# EAGLE design TaaraNodeEthernetProto (EAGLE 6.5.0)
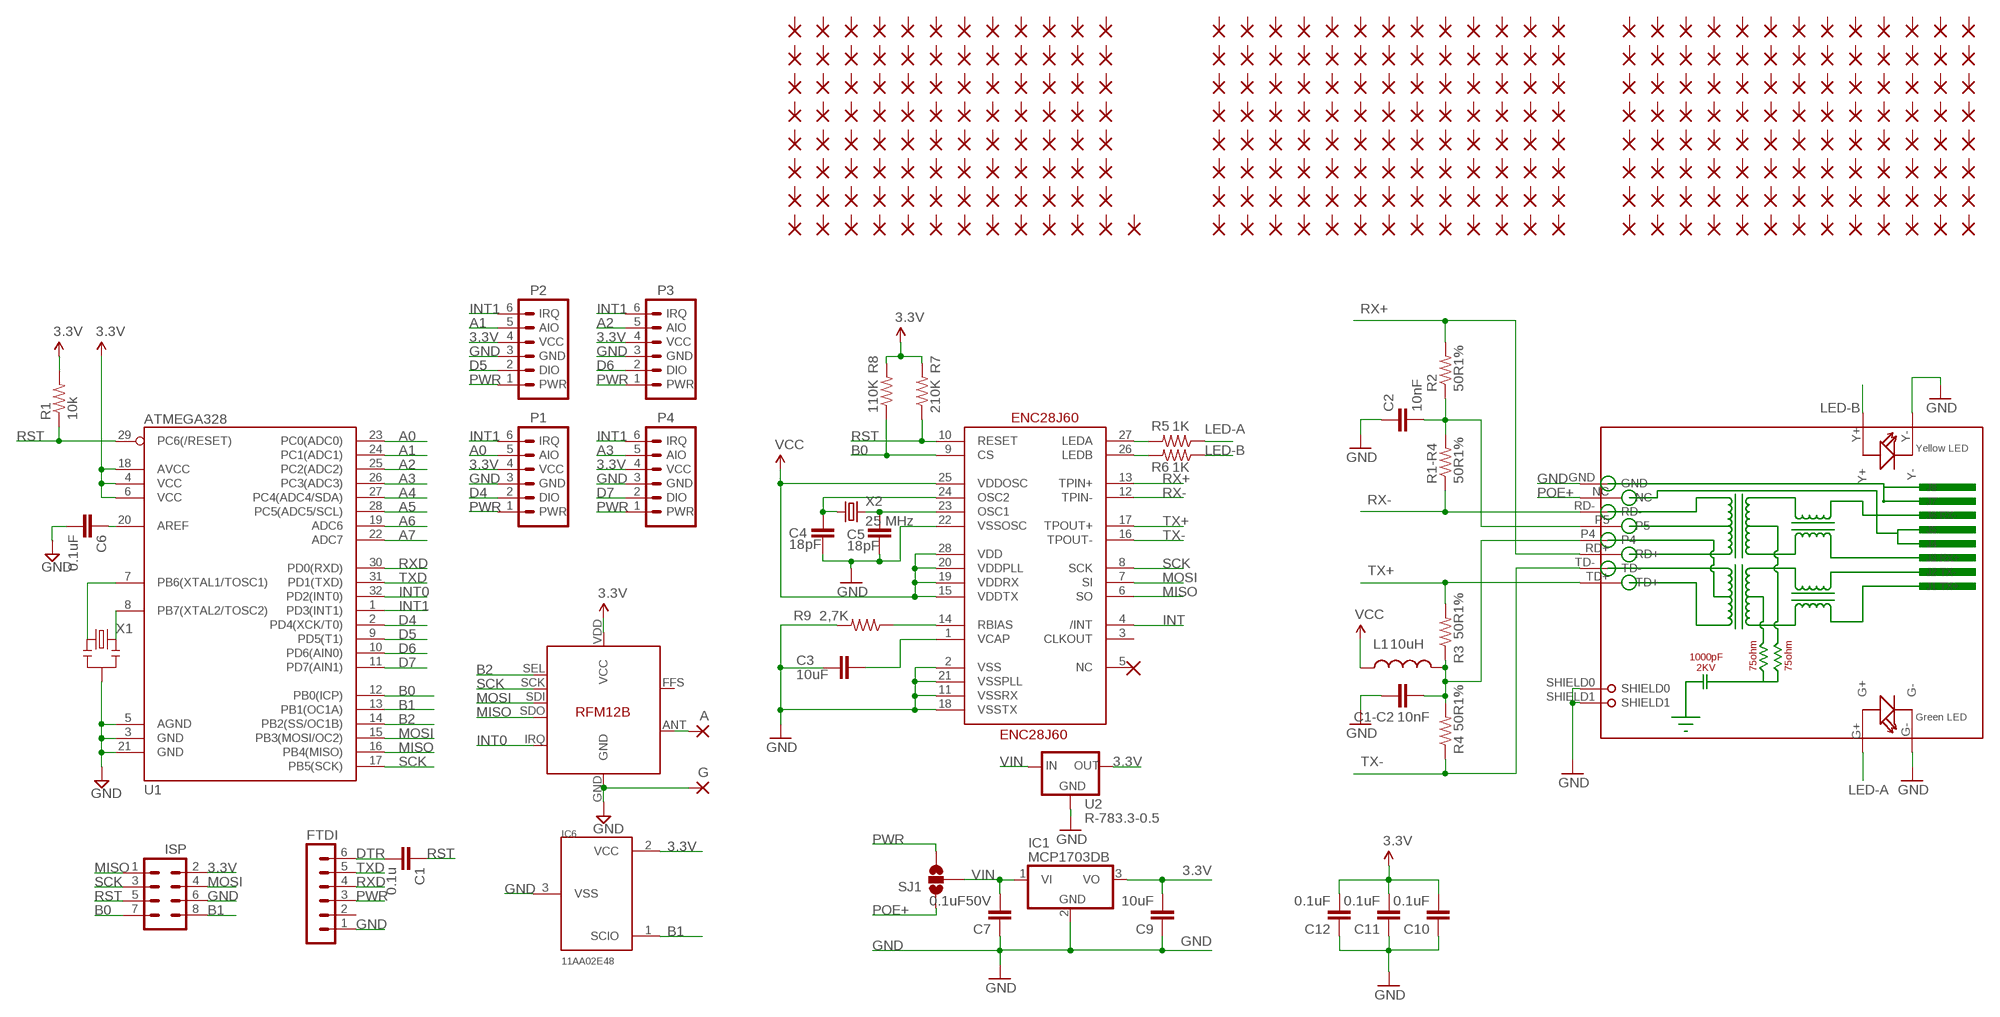
[diagram p0: schematic, sheet 1]

## Parts
A  1,6/0,8  [1,6/0,8]
C1  0.1u  CAP0603-CAP  [0603-CAP]
C1-C2  10nF  CAP0603-CAP  [0603-CAP]
C2  10nF  CAP0603-CAP  [0603-CAP]
C3  10uF  CAP0603-CAP  [0603-CAP]
C4  18pF  CAP0603-CAP  [0603-CAP]
C5  18pF  CAP0603-CAP  [0603-CAP]
C6  0.1uF  CAP0603-CAP  [0603-CAP]
C7  0.1uF50V  CAP0603-CAP  [0603-CAP]
C9  10uF  CAP0603-CAP  [0603-CAP]
C10  0.1uF  CAP0603-CAP  [0603-CAP]
C11  0.1uF  CAP0603-CAP  [0603-CAP]
C12  0.1uF  CAP0603-CAP  [0603-CAP]
ENC28J60  ENC28J60  [SSOP28DB]
FTDI  MA06-1  [MA06-1]
G  1,6/0,8  [1,6/0,8]
IC1  MCP1703DB  [SOT223]
IC6  11AA02E48  [SOT23]
L1  10uH  INDUCTOR0805  [0805]
P1  JEEPORT-FEMALE  [1X06_FEMALE_LOCK.010]
P2  JEEPORT-FEMALE  [1X06_FEMALE_LOCK.010]
P3  JEEPORT-FEMALE  [1X06_FEMALE_LOCK.010]
P4  JEEPORT-FEMALE  [1X06_FEMALE_LOCK.010]
PAD1  1,6/0,8  [1,6/0,8]
PAD2  1,6/0,8  [1,6/0,8]
PAD3  1,6/0,8  [1,6/0,8]
PAD4  1,6/0,8  [1,6/0,8]
PAD5  1,6/0,8  [1,6/0,8]
PAD6  1,6/0,8  [1,6/0,8]
PAD7  1,6/0,8  [1,6/0,8]
PAD8  1,6/0,8  [1,6/0,8]
PAD9  1,6/0,8  [1,6/0,8]
PAD10  1,6/0,8  [1,6/0,8]
PAD11  1,6/0,8  [1,6/0,8]
PAD12  1,6/0,8  [1,6/0,8]
PAD13  1,6/0,8  [1,6/0,8]
PAD14  1,6/0,8  [1,6/0,8]
PAD15  1,6/0,8  [1,6/0,8]
PAD16  1,6/0,8  [1,6/0,8]
PAD17  1,6/0,8  [1,6/0,8]
PAD18  1,6/0,8  [1,6/0,8]
PAD19  1,6/0,8  [1,6/0,8]
PAD20  1,6/0,8  [1,6/0,8]
PAD21  1,6/0,8  [1,6/0,8]
PAD22  1,6/0,8  [1,6/0,8]
PAD23  1,6/0,8  [1,6/0,8]
PAD24  1,6/0,8  [1,6/0,8]
PAD25  1,6/0,8  [1,6/0,8]
PAD26  1,6/0,8  [1,6/0,8]
PAD27  1,6/0,8  [1,6/0,8]
PAD28  1,6/0,8  [1,6/0,8]
PAD29  1,6/0,8  [1,6/0,8]
PAD30  1,6/0,8  [1,6/0,8]
PAD31  1,6/0,8  [1,6/0,8]
PAD32  1,6/0,8  [1,6/0,8]
PAD33  1,6/0,8  [1,6/0,8]
PAD34  1,6/0,8  [1,6/0,8]
PAD35  1,6/0,8  [1,6/0,8]
PAD36  1,6/0,8  [1,6/0,8]
PAD37  1,6/0,8  [1,6/0,8]
PAD38  1,6/0,8  [1,6/0,8]
PAD39  1,6/0,8  [1,6/0,8]
PAD40  1,6/0,8  [1,6/0,8]
PAD41  1,6/0,8  [1,6/0,8]
PAD42  1,6/0,8  [1,6/0,8]
PAD43  1,6/0,8  [1,6/0,8]
PAD44  1,6/0,8  [1,6/0,8]
PAD45  1,6/0,8  [1,6/0,8]
PAD46  1,6/0,8  [1,6/0,8]
PAD47  1,6/0,8  [1,6/0,8]
PAD48  1,6/0,8  [1,6/0,8]
PAD49  1,6/0,8  [1,6/0,8]
PAD50  1,6/0,8  [1,6/0,8]
PAD51  1,6/0,8  [1,6/0,8]
PAD52  1,6/0,8  [1,6/0,8]
PAD53  1,6/0,8  [1,6/0,8]
PAD54  1,6/0,8  [1,6/0,8]
PAD55  1,6/0,8  [1,6/0,8]
PAD56  1,6/0,8  [1,6/0,8]
PAD57  1,6/0,8  [1,6/0,8]
PAD58  1,6/0,8  [1,6/0,8]
PAD59  1,6/0,8  [1,6/0,8]
PAD60  1,6/0,8  [1,6/0,8]
PAD61  1,6/0,8  [1,6/0,8]
PAD62  1,6/0,8  [1,6/0,8]
PAD63  1,6/0,8  [1,6/0,8]
PAD64  1,6/0,8  [1,6/0,8]
PAD65  1,6/0,8  [1,6/0,8]
PAD66  1,6/0,8  [1,6/0,8]
PAD67  1,6/0,8  [1,6/0,8]
PAD68  1,6/0,8  [1,6/0,8]
PAD69  1,6/0,8  [1,6/0,8]
PAD70  1,6/0,8  [1,6/0,8]
PAD71  1,6/0,8  [1,6/0,8]
PAD72  1,6/0,8  [1,6/0,8]
PAD73  1,6/0,8  [1,6/0,8]
PAD74  1,6/0,8  [1,6/0,8]
PAD75  1,6/0,8  [1,6/0,8]
PAD76  1,6/0,8  [1,6/0,8]
PAD77  1,6/0,8  [1,6/0,8]
PAD78  1,6/0,8  [1,6/0,8]
PAD79  1,6/0,8  [1,6/0,8]
PAD80  1,6/0,8  [1,6/0,8]
PAD81  1,6/0,8  [1,6/0,8]
PAD82  1,6/0,8  [1,6/0,8]
PAD83  1,6/0,8  [1,6/0,8]
PAD84  1,6/0,8  [1,6/0,8]
PAD85  1,6/0,8  [1,6/0,8]
PAD86  1,6/0,8  [1,6/0,8]
PAD87  1,6/0,8  [1,6/0,8]
PAD88  1,6/0,8  [1,6/0,8]
PAD89  1,6/0,8  [1,6/0,8]
PAD90  1,6/0,8  [1,6/0,8]
PAD91  1,6/0,8  [1,6/0,8]
PAD92  1,6/0,8  [1,6/0,8]
PAD93  1,6/0,8  [1,6/0,8]
PAD94  1,6/0,8  [1,6/0,8]
PAD95  1,6/0,8  [1,6/0,8]
PAD96  1,6/0,8  [1,6/0,8]
PAD97  1,6/0,8  [1,6/0,8]
PAD98  1,6/0,8  [1,6/0,8]
PAD99  1,6/0,8  [1,6/0,8]
PAD100  1,6/0,8  [1,6/0,8]
PAD101  1,6/0,8  [1,6/0,8]
PAD102  1,6/0,8  [1,6/0,8]
PAD103  1,6/0,8  [1,6/0,8]
PAD104  1,6/0,8  [1,6/0,8]
PAD105  1,6/0,8  [1,6/0,8]
PAD106  1,6/0,8  [1,6/0,8]
PAD107  1,6/0,8  [1,6/0,8]
PAD108  1,6/0,8  [1,6/0,8]
PAD109  1,6/0,8  [1,6/0,8]
PAD110  1,6/0,8  [1,6/0,8]
PAD111  1,6/0,8  [1,6/0,8]
PAD112  1,6/0,8  [1,6/0,8]
PAD113  1,6/0,8  [1,6/0,8]
PAD114  1,6/0,8  [1,6/0,8]
PAD115  1,6/0,8  [1,6/0,8]
PAD116  1,6/0,8  [1,6/0,8]
PAD117  1,6/0,8  [1,6/0,8]
PAD118  1,6/0,8  [1,6/0,8]
PAD119  1,6/0,8  [1,6/0,8]
PAD120  1,6/0,8  [1,6/0,8]
PAD121  1,6/0,8  [1,6/0,8]
PAD122  1,6/0,8  [1,6/0,8]
PAD123  1,6/0,8  [1,6/0,8]
PAD124  1,6/0,8  [1,6/0,8]
PAD125  1,6/0,8  [1,6/0,8]
PAD126  1,6/0,8  [1,6/0,8]
PAD127  1,6/0,8  [1,6/0,8]
PAD128  1,6/0,8  [1,6/0,8]
PAD129  1,6/0,8  [1,6/0,8]
PAD130  1,6/0,8  [1,6/0,8]
PAD131  1,6/0,8  [1,6/0,8]
PAD132  1,6/0,8  [1,6/0,8]
PAD133  1,6/0,8  [1,6/0,8]
PAD134  1,6/0,8  [1,6/0,8]
PAD135  1,6/0,8  [1,6/0,8]
PAD136  1,6/0,8  [1,6/0,8]
PAD137  1,6/0,8  [1,6/0,8]
PAD138  1,6/0,8  [1,6/0,8]
PAD139  1,6/0,8  [1,6/0,8]
PAD140  1,6/0,8  [1,6/0,8]
PAD141  1,6/0,8  [1,6/0,8]
PAD142  1,6/0,8  [1,6/0,8]
PAD143  1,6/0,8  [1,6/0,8]
PAD144  1,6/0,8  [1,6/0,8]
PAD145  1,6/0,8  [1,6/0,8]
PAD146  1,6/0,8  [1,6/0,8]
PAD147  1,6/0,8  [1,6/0,8]
PAD148  1,6/0,8  [1,6/0,8]
PAD149  1,6/0,8  [1,6/0,8]
PAD150  1,6/0,8  [1,6/0,8]
PAD151  1,6/0,8  [1,6/0,8]
PAD152  1,6/0,8  [1,6/0,8]
PAD153  1,6/0,8  [1,6/0,8]
PAD154  1,6/0,8  [1,6/0,8]
PAD155  1,6/0,8  [1,6/0,8]
PAD156  1,6/0,8  [1,6/0,8]
PAD157  1,6/0,8  [1,6/0,8]
PAD158  1,6/0,8  [1,6/0,8]
PAD159  1,6/0,8  [1,6/0,8]
PAD160  1,6/0,8  [1,6/0,8]
PAD161  1,6/0,8  [1,6/0,8]
PAD162  1,6/0,8  [1,6/0,8]
PAD163  1,6/0,8  [1,6/0,8]
PAD164  1,6/0,8  [1,6/0,8]
PAD165  1,6/0,8  [1,6/0,8]
PAD166  1,6/0,8  [1,6/0,8]
PAD167  1,6/0,8  [1,6/0,8]
PAD168  1,6/0,8  [1,6/0,8]
PAD169  1,6/0,8  [1,6/0,8]
PAD170  1,6/0,8  [1,6/0,8]
PAD171  1,6/0,8  [1,6/0,8]
PAD172  1,6/0,8  [1,6/0,8]
PAD173  1,6/0,8  [1,6/0,8]
PAD174  1,6/0,8  [1,6/0,8]
PAD175  1,6/0,8  [1,6/0,8]
PAD176  1,6/0,8  [1,6/0,8]
PAD177  1,6/0,8  [1,6/0,8]
PAD178  1,6/0,8  [1,6/0,8]
PAD179  1,6/0,8  [1,6/0,8]
PAD180  1,6/0,8  [1,6/0,8]
PAD181  1,6/0,8  [1,6/0,8]
PAD182  1,6/0,8  [1,6/0,8]
PAD183  1,6/0,8  [1,6/0,8]
PAD184  1,6/0,8  [1,6/0,8]
PAD185  1,6/0,8  [1,6/0,8]
PAD186  1,6/0,8  [1,6/0,8]
PAD187  1,6/0,8  [1,6/0,8]
PAD188  1,6/0,8  [1,6/0,8]
PAD189  1,6/0,8  [1,6/0,8]
PAD190  1,6/0,8  [1,6/0,8]
PAD191  1,6/0,8  [1,6/0,8]
PAD192  1,6/0,8  [1,6/0,8]
PAD193  1,6/0,8  [1,6/0,8]
PAD194  1,6/0,8  [1,6/0,8]
PAD195  1,6/0,8  [1,6/0,8]
PAD196  1,6/0,8  [1,6/0,8]
PAD197  1,6/0,8  [1,6/0,8]
PAD198  1,6/0,8  [1,6/0,8]
PAD199  1,6/0,8  [1,6/0,8]
PAD200  1,6/0,8  [1,6/0,8]
PAD201  1,6/0,8  [1,6/0,8]
PAD202  1,6/0,8  [1,6/0,8]
PAD203  1,6/0,8  [1,6/0,8]
PAD204  1,6/0,8  [1,6/0,8]
PAD205  1,6/0,8  [1,6/0,8]
PAD206  1,6/0,8  [1,6/0,8]
PAD207  1,6/0,8  [1,6/0,8]
PAD208  1,6/0,8  [1,6/0,8]
PAD209  1,6/0,8  [1,6/0,8]
PAD210  1,6/0,8  [1,6/0,8]
PAD211  1,6/0,8  [1,6/0,8]
PAD212  1,6/0,8  [1,6/0,8]
PAD213  1,6/0,8  [1,6/0,8]
PAD214  1,6/0,8  [1,6/0,8]
PAD215  1,6/0,8  [1,6/0,8]
PAD216  1,6/0,8  [1,6/0,8]
PAD217  1,6/0,8  [1,6/0,8]
PAD218  1,6/0,8  [1,6/0,8]
PAD219  1,6/0,8  [1,6/0,8]
PAD220  1,6/0,8  [1,6/0,8]
PAD221  1,6/0,8  [1,6/0,8]
PAD222  1,6/0,8  [1,6/0,8]
PAD223  1,6/0,8  [1,6/0,8]
PAD224  1,6/0,8  [1,6/0,8]
PAD225  1,6/0,8  [1,6/0,8]
PAD226  1,6/0,8  [1,6/0,8]
PAD227  1,6/0,8  [1,6/0,8]
PAD228  1,6/0,8  [1,6/0,8]
PAD229  1,6/0,8  [1,6/0,8]
PAD230  1,6/0,8  [1,6/0,8]
PAD231  1,6/0,8  [1,6/0,8]
PAD232  1,6/0,8  [1,6/0,8]
PAD233  1,6/0,8  [1,6/0,8]
PAD234  1,6/0,8  [1,6/0,8]
PAD235  1,6/0,8  [1,6/0,8]
PAD236  1,6/0,8  [1,6/0,8]
PAD237  1,6/0,8  [1,6/0,8]
PAD238  1,6/0,8  [1,6/0,8]
PAD239  1,6/0,8  [1,6/0,8]
PAD240  1,6/0,8  [1,6/0,8]
PAD241  1,6/0,8  [1,6/0,8]
PAD242  1,6/0,8  [1,6/0,8]
PAD243  1,6/0,8  [1,6/0,8]
PAD244  1,6/0,8  [1,6/0,8]
PAD245  1,6/0,8  [1,6/0,8]
PAD246  1,6/0,8  [1,6/0,8]
PAD247  1,6/0,8  [1,6/0,8]
PAD248  1,6/0,8  [1,6/0,8]
PAD249  1,6/0,8  [1,6/0,8]
PAD250  1,6/0,8  [1,6/0,8]
PAD251  1,6/0,8  [1,6/0,8]
PAD252  1,6/0,8  [1,6/0,8]
PAD253  1,6/0,8  [1,6/0,8]
PAD254  1,6/0,8  [1,6/0,8]
PAD255  1,6/0,8  [1,6/0,8]
PAD256  1,6/0,8  [1,6/0,8]
PAD257  1,6/0,8  [1,6/0,8]
PAD258  1,6/0,8  [1,6/0,8]
PAD259  1,6/0,8  [1,6/0,8]
PAD260  1,6/0,8  [1,6/0,8]
PAD261  1,6/0,8  [1,6/0,8]
PAD262  1,6/0,8  [1,6/0,8]
PAD263  1,6/0,8  [1,6/0,8]
PAD264  1,6/0,8  [1,6/0,8]
PAD265  1,6/0,8  [1,6/0,8]
PAD266  1,6/0,8  [1,6/0,8]
PAD267  1,6/0,8  [1,6/0,8]
PAD268  1,6/0,8  [1,6/0,8]
PAD269  1,6/0,8  [1,6/0,8]
PAD270  1,6/0,8  [1,6/0,8]
PAD271  1,6/0,8  [1,6/0,8]
PAD272  1,6/0,8  [1,6/0,8]
PAD273  1,6/0,8  [1,6/0,8]
PAD274  1,6/0,8  [1,6/0,8]
PAD275  1,6/0,8  [1,6/0,8]
PAD276  1,6/0,8  [1,6/0,8]
PAD277  1,6/0,8  [1,6/0,8]
PAD278  1,6/0,8  [1,6/0,8]
PAD279  1,6/0,8  [1,6/0,8]
PAD280  1,6/0,8  [1,6/0,8]
PAD281  1,6/0,8  [1,6/0,8]
PAD282  1,6/0,8  [1,6/0,8]
PAD283  1,6/0,8  [1,6/0,8]
PAD284  1,6/0,8  [1,6/0,8]
PAD285  1,6/0,8  [1,6/0,8]
PAD286  1,6/0,8  [1,6/0,8]
PAD287  1,6/0,8  [1,6/0,8]
PAD288  1,6/0,8  [1,6/0,8]
PAD289  1,6/0,8  [1,6/0,8]
PAD290  1,6/0,8  [1,6/0,8]
PAD291  1,6/0,8  [1,6/0,8]
PAD292  1,6/0,8  [1,6/0,8]
PAD293  1,6/0,8  [1,6/0,8]
PAD294  1,6/0,8  [1,6/0,8]
PAD295  1,6/0,8  [1,6/0,8]
PAD296  1,6/0,8  [1,6/0,8]
PAD297  1,6/0,8  [1,6/0,8]
PAD298  1,6/0,8  [1,6/0,8]
PAD299  1,6/0,8  [1,6/0,8]
PAD300  1,6/0,8  [1,6/0,8]
PAD301  1,6/0,8  [1,6/0,8]
PAD302  1,6/0,8  [1,6/0,8]
PAD303  1,6/0,8  [1,6/0,8]
PAD304  1,6/0,8  [1,6/0,8]
PAD305  1,6/0,8  [1,6/0,8]
R1  10k  RESISTOR0603-RES  [0603-RES]
R1-R4  50R1%  RESISTOR0603-RES  [0603-RES]
R2  50R1%  RESISTOR0603-RES  [0603-RES]
R3  50R1%  RESISTOR0603-RES  [0603-RES]
R4  50R1%  RESISTOR0603-RES  [0603-RES]
R5  1K  RESISTOR0603-RES  [0603-RES]
R6  1K  RESISTOR0603-RES  [0603-RES]
R7  210K  RESISTOR0603-RES  [0603-RES]
R8  110K  RESISTOR0603-RES  [0603-RES]
R9  2,7K  RESISTOR0603-RES  [0603-RES]
RJ1  HLJ-6115ANL  [HR911105A]
SJ1  SOLDERJUMPER_2WAYT  [SJ_2]
SV7  ISP  MA04-2  [MA04-2]
U1  ATMEGA328  ATMEGA168  [TQFP32-08]
U2  R-783.3-0.5  R-78XX  [R-78XX]
U$1  RFM12B  [RFM12B]
X1  RESONATORSMD  [RESONATOR-SMD]
X2  25 MHz  CRYSTAL3.2X2.5  [CRYSTAL-SMD-3.2X2.5]

## Nets
3.3V [power]: C9.2 C10.2 C11.2 C12.2 ENC28J60.15(VDDTX) ENC28J60.19(VDDRX) ENC28J60.20(VDDPLL) ENC28J60.25(VDDOSC) ENC28J60.28(VDD) IC1.3(VO) IC6.2(VCC) L1.1 P1.4(VCC) P2.4(VCC) P3.4(VCC) P4.4(VCC) R1.2 R7.2 R8.2 SV7.2 U1.4(VCC) U1.6(VCC) U1.18(AVCC) U2.OUT U$1.VDD(VCC) ; supply symbol labelled VCC
A0: P1.5(AIO) U1.23(PC0(ADC0))
A1: P2.5(AIO) U1.24(PC1(ADC1))
A2: P3.5(AIO) U1.25(PC2(ADC2))
A3: P4.5(AIO) U1.26(PC3(ADC3))
A4: U1.27(PC4(ADC4/SDA))
A5: U1.28(PC5(ADC5/SCL))
A6: U1.19(ADC6)
A7: U1.22(ADC7)
B0: ENC28J60.9(CS) R8.1 SV7.7 U1.12(PB0(ICP))
B1: IC6.1(SCIO) SV7.8 U1.13(PB1(OC1A))
B2: U1.14(PB2(SS/OC1B)) U$1.SEL
D4: P1.2(DIO) U1.2(PD4(XCK/T0))
D5: P2.2(DIO) U1.9(PD5(T1))
D6: P3.2(DIO) U1.10(PD6(AIN0))
D7: P4.2(DIO) U1.11(PD7(AIN1))
DTR: C1.2 FTDI.6
GND [power]: C1-C2.1 C2.1 C3.1 C4.1 C5.1 C6.2 C7.1 C9.1 C10.1 C11.1 C12.1 ENC28J60.2(VSS) ENC28J60.11(VSSRX) ENC28J60.18(VSSTX) ENC28J60.21(VSSPLL) ENC28J60.22(VSSOSC) FTDI.1 G.1(P) IC1.2(GND) IC6.3(VSS) P1.3(GND) P2.3(GND) P3.3(GND) P4.3(GND) R9.2 RJ1.G- RJ1.GND RJ1.SHIELD0 RJ1.SHIELD1 RJ1.Y- SV7.6 U1.3(GND) U1.5(AGND) U1.21(GND) U2.GND U$1.GND X1.2
INT: ENC28J60.4(/INT)
INT0: U1.32(PD2(INT0)) U$1.IRQ
INT1: P1.6(IRQ) P2.6(IRQ) P3.6(IRQ) P4.6(IRQ) U1.1(PD3(INT1))
LED-A: R5.1 RJ1.G+
LED-B: R6.1 RJ1.Y+
MISO: ENC28J60.6(SO) SV7.1 U1.16(PB4(MISO)) U$1.SDO
MOSI: ENC28J60.7(SI) SV7.4 U1.15(PB3(MOSI/OC2)) U$1.SDI
N$1: U1.7(PB6(XTAL1/TOSC1)) X1.1
N$2: C6.1 U1.20(AREF)
N$9: ENC28J60.27(LEDA) R5.2
N$10: ENC28J60.26(LEDB) R6.2
N$12: ENC28J60.14(RBIAS) R9.1
N$13: C3.2 ENC28J60.1(VCAP)
N$15: C4.2 ENC28J60.24(OSC2) X2.1
N$16: C5.2 ENC28J60.23(OSC1) X2.3
N$18: A.1(P) U$1.ANT
N$21: U1.8(PB7(XTAL2/TOSC2)) X1.3
POE+ [power]: RJ1.NC SJ1.1
PWR [power]: FTDI.3 P1.1(PWR) P2.1(PWR) P3.1(PWR) P4.1(PWR) SJ1.3
RCT: C2.2 R1-R4.2 R2.1 RJ1.P5
RST: C1.1 ENC28J60.10(RESET) R1.1 R7.1 SV7.5 U1.29(PC6(/RESET))
RX+: ENC28J60.13(TPIN+) R2.2 RJ1.RD+
RX-: ENC28J60.12(TPIN-) R1-R4.1 RJ1.RD-
RXD: FTDI.4 U1.30(PD0(RXD))
SCK: ENC28J60.8(SCK) SV7.3 U1.17(PB5(SCK)) U$1.SCK
TCT: C1-C2.2 L1.2 R3.1 R4.2 RJ1.P4
TX+: ENC28J60.17(TPOUT+) R3.2 RJ1.TD+
TX-: ENC28J60.16(TPOUT-) R4.1 RJ1.TD-
TXD: FTDI.5 U1.31(PD1(TXD))
VIN [power]: C7.2 IC1.1(VI) SJ1.2 U2.IN
Unconnected: ENC28J60.3(CLKOUT) ENC28J60.5(NC) FTDI.2 PAD1.1(P) PAD2.1(P) PAD3.1(P) PAD4.1(P) PAD5.1(P) PAD6.1(P) PAD7.1(P) PAD8.1(P) PAD9.1(P) PAD10.1(P) PAD11.1(P) PAD12.1(P) PAD13.1(P) PAD14.1(P) PAD15.1(P) PAD16.1(P) PAD17.1(P) PAD18.1(P) PAD19.1(P) PAD20.1(P) PAD21.1(P) PAD22.1(P) PAD23.1(P) PAD24.1(P) PAD25.1(P) PAD26.1(P) PAD27.1(P) PAD28.1(P) PAD29.1(P) PAD30.1(P) PAD31.1(P) PAD32.1(P) PAD33.1(P) PAD34.1(P) PAD35.1(P) PAD36.1(P) PAD37.1(P) PAD38.1(P) PAD39.1(P) PAD40.1(P) PAD41.1(P) PAD42.1(P) PAD43.1(P) PAD44.1(P) PAD45.1(P) PAD46.1(P) PAD47.1(P) PAD48.1(P) PAD49.1(P) PAD50.1(P) PAD51.1(P) PAD52.1(P) PAD53.1(P) PAD54.1(P) PAD55.1(P) PAD56.1(P) PAD57.1(P) PAD58.1(P) PAD59.1(P) PAD60.1(P) PAD61.1(P) PAD62.1(P) PAD63.1(P) PAD64.1(P) PAD65.1(P) PAD66.1(P) PAD67.1(P) PAD68.1(P) PAD69.1(P) PAD70.1(P) PAD71.1(P) PAD72.1(P) PAD73.1(P) PAD74.1(P) PAD75.1(P) PAD76.1(P) PAD77.1(P) PAD78.1(P) PAD79.1(P) PAD80.1(P) PAD81.1(P) PAD82.1(P) PAD83.1(P) PAD84.1(P) PAD85.1(P) PAD86.1(P) PAD87.1(P) PAD88.1(P) PAD89.1(P) PAD90.1(P) PAD91.1(P) PAD92.1(P) PAD93.1(P) PAD94.1(P) PAD95.1(P) PAD96.1(P) PAD97.1(P) PAD98.1(P) PAD99.1(P) PAD100.1(P) PAD101.1(P) PAD102.1(P) PAD103.1(P) PAD104.1(P) PAD105.1(P) PAD106.1(P) PAD107.1(P) PAD108.1(P) PAD109.1(P) PAD110.1(P) PAD111.1(P) PAD112.1(P) PAD113.1(P) PAD114.1(P) PAD115.1(P) PAD116.1(P) PAD117.1(P) PAD118.1(P) PAD119.1(P) PAD120.1(P) PAD121.1(P) PAD122.1(P) PAD123.1(P) PAD124.1(P) PAD125.1(P) PAD126.1(P) PAD127.1(P) PAD128.1(P) PAD129.1(P) PAD130.1(P) PAD131.1(P) PAD132.1(P) PAD133.1(P) PAD134.1(P) PAD135.1(P) PAD136.1(P) PAD137.1(P) PAD138.1(P) PAD139.1(P) PAD140.1(P) PAD141.1(P) PAD142.1(P) PAD143.1(P) PAD144.1(P) PAD145.1(P) PAD146.1(P) PAD147.1(P) PAD148.1(P) PAD149.1(P) PAD150.1(P) PAD151.1(P) PAD152.1(P) PAD153.1(P) PAD154.1(P) PAD155.1(P) PAD156.1(P) PAD157.1(P) PAD158.1(P) PAD159.1(P) PAD160.1(P) PAD161.1(P) PAD162.1(P) PAD163.1(P) PAD164.1(P) PAD165.1(P) PAD166.1(P) PAD167.1(P) PAD168.1(P) PAD169.1(P) PAD170.1(P) PAD171.1(P) PAD172.1(P) PAD173.1(P) PAD174.1(P) PAD175.1(P) PAD176.1(P) PAD177.1(P) PAD178.1(P) PAD179.1(P) PAD180.1(P) PAD181.1(P) PAD182.1(P) PAD183.1(P) PAD184.1(P) PAD185.1(P) PAD186.1(P) PAD187.1(P) PAD188.1(P) PAD189.1(P) PAD190.1(P) PAD191.1(P) PAD192.1(P) PAD193.1(P) PAD194.1(P) PAD195.1(P) PAD196.1(P) PAD197.1(P) PAD198.1(P) PAD199.1(P) PAD200.1(P) PAD201.1(P) PAD202.1(P) PAD203.1(P) PAD204.1(P) PAD205.1(P) PAD206.1(P) PAD207.1(P) PAD208.1(P) PAD209.1(P) PAD210.1(P) PAD211.1(P) PAD212.1(P) PAD213.1(P) PAD214.1(P) PAD215.1(P) PAD216.1(P) PAD217.1(P) PAD218.1(P) PAD219.1(P) PAD220.1(P) PAD221.1(P) PAD222.1(P) PAD223.1(P) PAD224.1(P) PAD225.1(P) PAD226.1(P) PAD227.1(P) PAD228.1(P) PAD229.1(P) PAD230.1(P) PAD231.1(P) PAD232.1(P) PAD233.1(P) PAD234.1(P) PAD235.1(P) PAD236.1(P) PAD237.1(P) PAD238.1(P) PAD239.1(P) PAD240.1(P) PAD241.1(P) PAD242.1(P) PAD243.1(P) PAD244.1(P) PAD245.1(P) PAD246.1(P) PAD247.1(P) PAD248.1(P) PAD249.1(P) PAD250.1(P) PAD251.1(P) PAD252.1(P) PAD253.1(P) PAD254.1(P) PAD255.1(P) PAD256.1(P) PAD257.1(P) PAD258.1(P) PAD259.1(P) PAD260.1(P) PAD261.1(P) PAD262.1(P) PAD263.1(P) PAD264.1(P) PAD265.1(P) PAD266.1(P) PAD267.1(P) PAD268.1(P) PAD269.1(P) PAD270.1(P) PAD271.1(P) PAD272.1(P) PAD273.1(P) PAD274.1(P) PAD275.1(P) PAD276.1(P) PAD277.1(P) PAD278.1(P) PAD279.1(P) PAD280.1(P) PAD281.1(P) PAD282.1(P) PAD283.1(P) PAD284.1(P) PAD285.1(P) PAD286.1(P) PAD287.1(P) PAD288.1(P) PAD289.1(P) PAD290.1(P) PAD291.1(P) PAD292.1(P) PAD293.1(P) PAD294.1(P) PAD295.1(P) PAD296.1(P) PAD297.1(P) PAD298.1(P) PAD299.1(P) PAD300.1(P) PAD301.1(P) PAD302.1(P) PAD303.1(P) PAD304.1(P) PAD305.1(P) U$1.FFS

## Library data of the parts
A G PAD1-PAD305 = wirepad:1,6/0,8: THROUGH-HOLE PAD
C1 C1-C2 C2-C7 C9-C12 = SparkFun:CAP: Capacitor Standard 0603 ceramic capacitor, and 0.1" leaded capacitor.
ENC28J60 = SparkFun:ENC28J60
FTDI = JeeLabs:MA06-1: PIN HEADER
IC1 = linear:MCP1703: 250 mA, 16V, Low Quiescent Current LDO Regulator Source: http://ww1.microchip.com/downloads/en/DeviceDoc/22049b.pdf
IC6 = nanode:11AA02E48
L1 = SparkFun:INDUCTOR: Inductors Basic Inductor/Choke - 0603 and 1206. Footprints are not proven and vary greatly between part numbers.
P1-P4 = JeeLabs:JEEPORT: PIN HEADER
R1 R1-R4 R2-R9 = SparkFun:RESISTOR: Resistor Basic schematic elements and footprints for 0603, 1206, and PTH resistors.
RJ1 = Itead_BP_110825:HLJ-6115ANL: SOC015
SJ1 = SparkFun:SOLDERJUMPER_2WAY: Solder Jumper 2 way solder jumper
SV7 = JeeLabs:MA04-2: PIN HEADER
U1 = SparkFun:ATMEGA168
U2 = omc:R-78XX: Recom R78xx - Switching Regulator - pin-out compatible with LM78xx - up to 97% efficiency - input range 4.75V to 18V for 1A or 34V for 0.5A version, resp. - L * W * H = 11.5mm * 7.5mm * 10.2mm - low ripple and noise (less than 30mVpp) - short circuit protection, thermal shutdown
U$1 = JeeLabs:RFM12B
X1 = SparkFun:RESONATOR: Resonator Small SMD resonator. This is the itty bitty 10/20MHz resonators with built in caps. CSTCE10M0G55 and CSTCE20M0V53. Footprint has been reviewed closely but hasn't been tested yet.
X2 = JeeLabs:CRYSTAL: Crystals Various standard crystals. Proven footprints. Spark Fun Electronics SKU : COM-00534

## Net classes
0 default: width 0.203 mm, clearance 0.203 mm
1 power: width 0.381 mm, clearance 0.254 mm

## Board
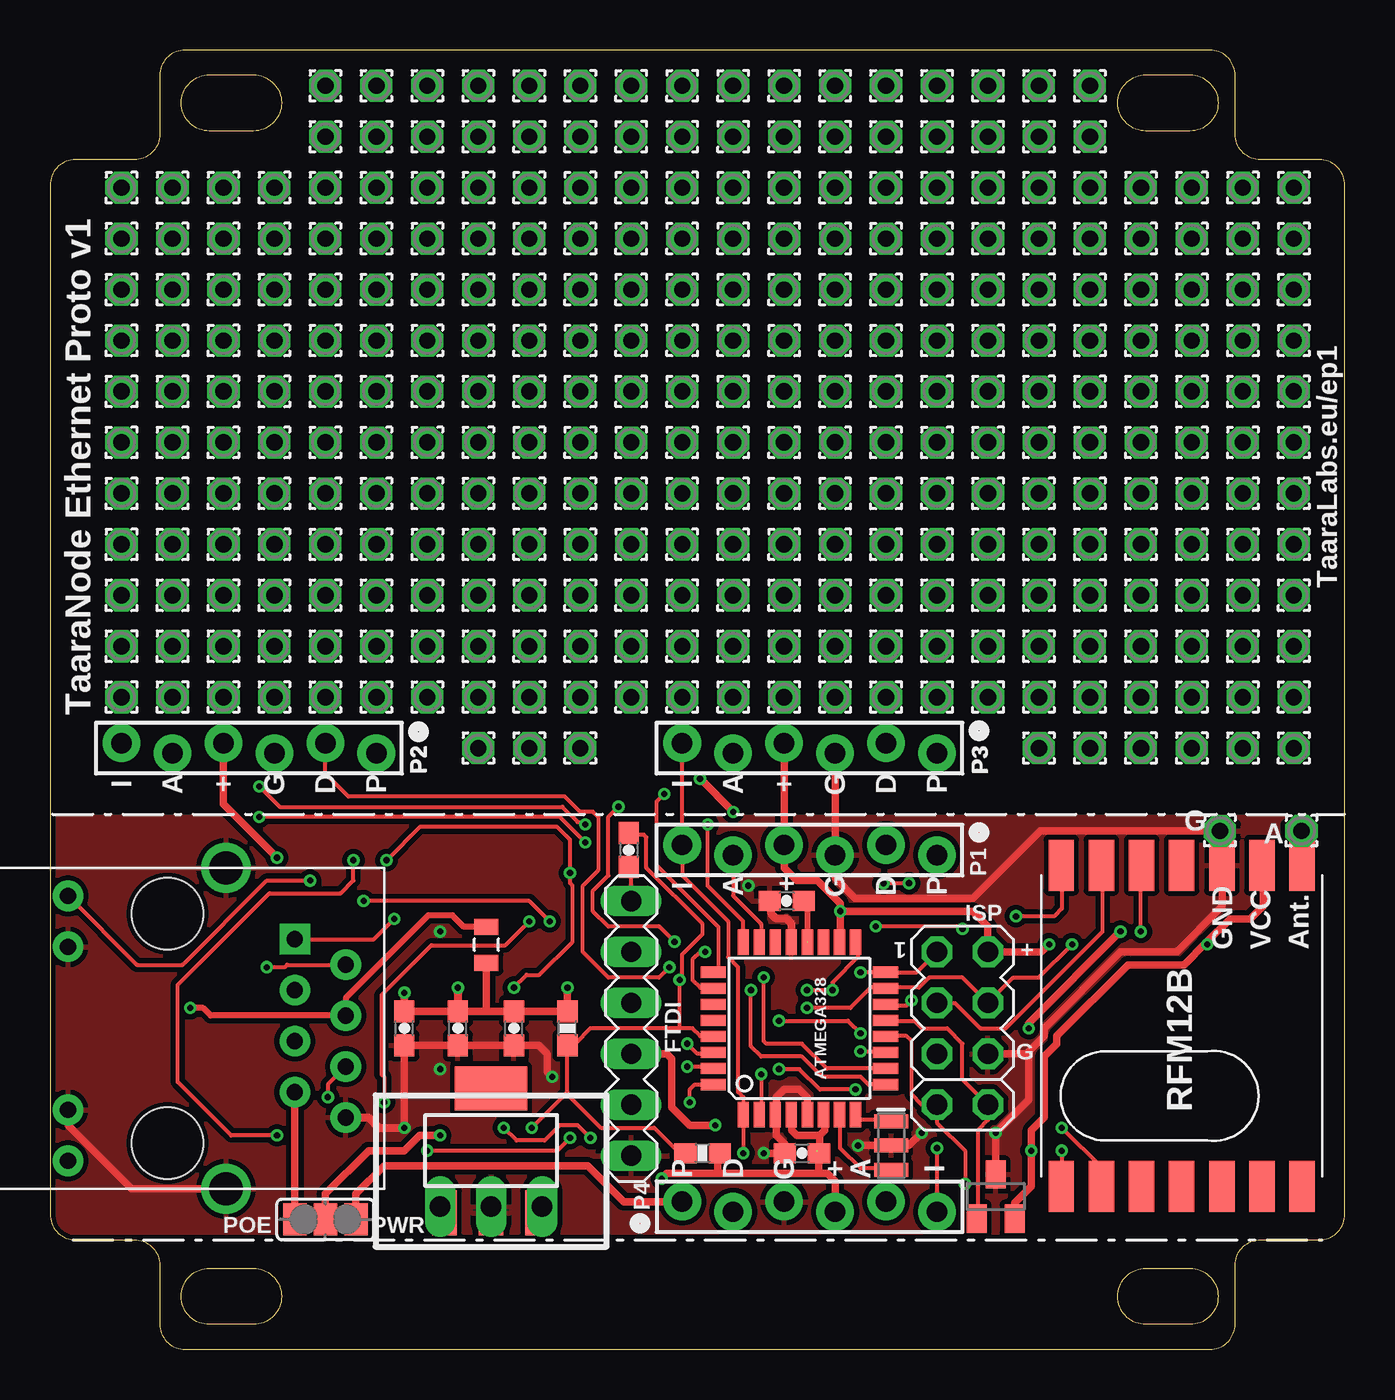
[diagram p1: board, top side]
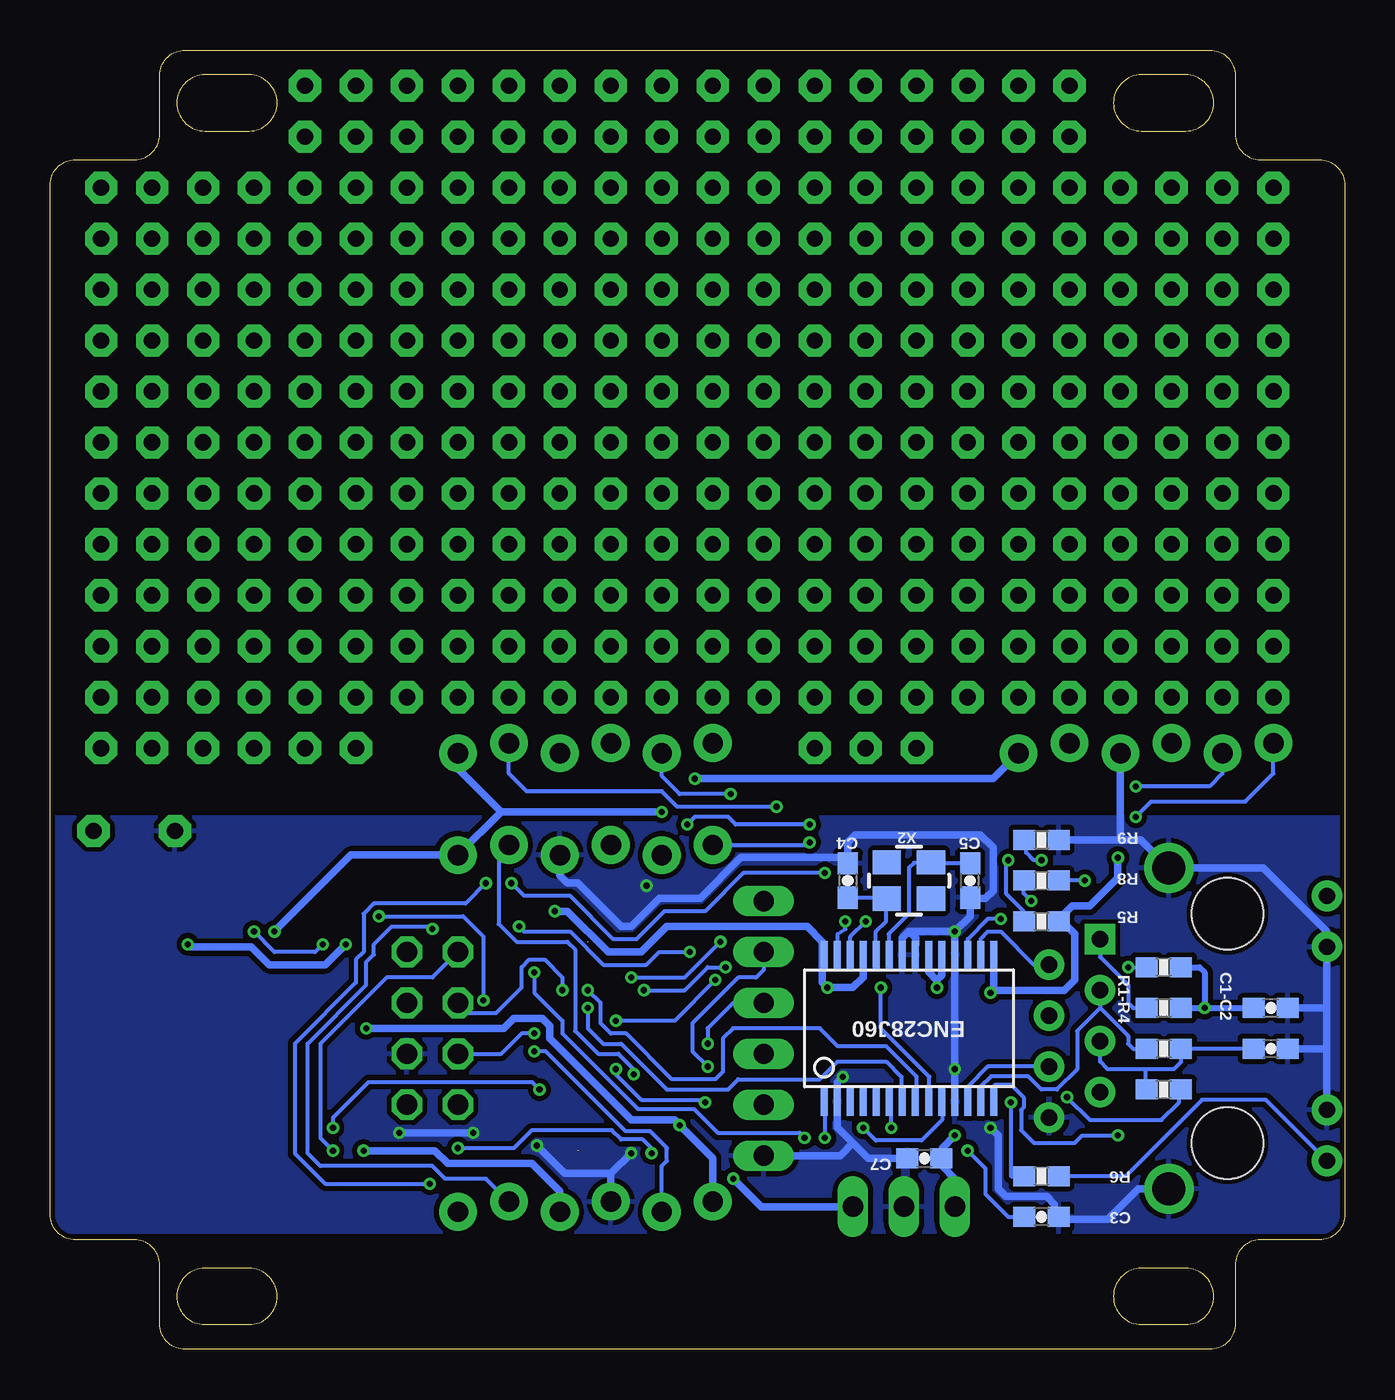
[diagram p2: board, bottom side, seen from below]

Size 64.52 x 64.77 mm. Coordinates in mm from the lower left corner, seen from the top.
Outline: 59.06,1.27 59.06,4.19 arc-90 60.33,5.46 63.25,5.46 arc90 64.52,6.73 64.52,58.04 arc90 63.25,59.31 60.33,59.31 arc-90 59.06,60.58 59.06,63.5 arc90 57.79,64.77 6.73,64.77 arc90 5.46,63.5 5.46,60.58 arc-90 4.19,59.31 1.27,59.31 arc90 0,58.04 0,6.73 arc90 1.27,5.46 4.19,5.46 arc-90 5.46,4.19 5.46,1.27 arc90 6.73,0 57.79,0 arc90 59.06,1.27
Outline: 6.53,62.14 arc-90 7.93,63.54 10.13,63.54 arc-90 11.53,62.14 arc-90 10.13,60.74 7.93,60.74 arc-90 6.53,62.14
Outline: 53.2,62.14 arc-90 54.6,63.54 56.8,63.54 arc-90 58.2,62.14 arc-90 56.8,60.74 54.6,60.74 arc-90 53.2,62.14
Outline: 6.53,2.64 arc-90 7.93,4.04 10.13,4.04 arc-90 11.53,2.64 arc-90 10.13,1.24 7.93,1.24 arc-90 6.53,2.64
Outline: 53.2,2.64 arc-90 54.6,4.04 56.8,4.04 arc-90 58.2,2.64 arc-90 56.8,1.24 54.6,1.24 arc-90 53.2,2.64
Copper layers (1*16): Top 0.035mm / dielectric 1.5mm / Bottom 0.035mm
Design rules "default": minimum track width 6mil, minimum drill 12mil, track to track 6mil, track to pad 6mil, pad to pad 6mil, via to via 6mil, smd to smd 0mil, copper to edge 10mil, drill to drill 10mil, minimum pad ring 10mil, minimum via ring 6mil, stop-mask expansion 2mil, vias tented up to drill 100mil, thermal gap 10mil

### Footprints (pad centres in the part's own frame; a part is rotated, then mirrored left to right if it is on the bottom)
1,6/0,8 = drill 0.813 pad 1.6 octagon: 1 0,0
0603-CAP = smd 1.1 x 1: 1 -0.85,0; 2 0.85,0
SSOP28DB = smd 0.348 x 1.397: 1 -4.225,-3.656; 2 -3.575,-3.656; 3 -2.925,-3.656; 4 -2.275,-3.656; 5 -1.625,-3.656; 6 -0.975,-3.656; 7 -0.325,-3.656; 8 0.325,-3.656; 9 0.975,-3.656; 10 1.625,-3.656; 11 2.275,-3.656; 12 2.925,-3.656; 13 3.575,-3.656; 14 4.225,-3.656; 15 4.225,3.656; 16 3.575,3.656; 17 2.925,3.656; 18 2.275,3.656; 19 1.625,3.656; 20 0.975,3.656; 21 0.325,3.656; 22 -0.325,3.656; 23 -0.975,3.656; 24 -1.625,3.656; 25 -2.275,3.656; 26 -2.925,3.656; 27 -3.575,3.656; 28 -4.225,3.656
MA06-1 = drill 1.016 long: 1 0,0; 2 2.54,0; 3 5.08,0; 4 7.62,0; 5 10.16,0; 6 12.7,0
SOT223 = smd 1.219 x 2.235: 1 -2.311,-3.099; 2 0,-3.099; 3 2.311,-3.099 | smd 3.6 x 2.2: 4 0,3.099
SOT23 = smd 1 x 1.4: 1 -0.95,-1.1; 2 0.95,-1.1; 3 0,1.1
0805 = smd 0.8 x 1.2: 1 -0.9,0; 2 0.9,0
1X06_FEMALE_LOCK.010 = drill 1.016 pad 1.88: 1 0,0.254; 2 2.54,-0.254; 3 5.08,0.254; 4 7.62,-0.254; 5 10.16,0.254; 6 12.7,-0.254
0603-RES = smd 1.1 x 1: 1 -0.85,0; 2 0.85,0
HR911105A = drill 0.813 pad 1.524: G+ 4.953,-6.604; G- 4.953,-4.064; GND -8.89,4.445; NC -6.35,3.175; P4 -8.89,-0.635; P5 -6.35,0.635; RD+ -6.35,-1.905; RD- -8.89,1.905; TD- -8.89,-3.175; Y+ 4.953,6.604; Y- 4.953,4.064 | drill 1.651 pad 2.159: SHIELD0 -2.921,8.001; SHIELD1 -2.921,-8.001 | drill 0.813 pad 1.524 square: TD+ -6.35,-4.445 | hole 3.556: 0,-5.715; 0,5.715
SJ_2 = smd 1.168 x 1.6: 1 -1.524,0; 2 0,0; 3 1.524,0
MA04-2 = drill 1.016 octagon: 1 -3.81,-1.27; 2 -3.81,1.27; 3 -1.27,-1.27; 4 -1.27,1.27; 5 1.27,-1.27; 6 1.27,1.27; 7 3.81,-1.27; 8 3.81,1.27
TQFP32-08 = smd 1.27 x 0.559: 1 -4.293,2.8; 2 -4.293,2; 3 -4.293,1.2; 4 -4.293,0.4; 5 -4.293,-0.4; 6 -4.293,-1.2; 7 -4.293,-2; 8 -4.293,-2.8; 17 4.293,-2.8; 18 4.293,-2; 19 4.293,-1.2; 20 4.293,-0.4; 21 4.293,0.4; 22 4.293,1.2; 23 4.293,2; 24 4.293,2.8 | smd 0.559 x 1.27: 9 -2.8,-4.293; 10 -2,-4.293; 11 -1.2,-4.293; 12 -0.4,-4.293; 13 0.4,-4.293; 14 1.2,-4.293; 15 2,-4.293; 16 2.8,-4.293; 25 2.8,4.293; 26 2,4.293; 27 1.2,4.293; 28 0.4,4.293; 29 -0.4,4.293; 30 -1.2,4.293; 31 -2,4.293; 32 -2.8,4.293
R-78XX = drill 1.016 long: GND 0,-1.775; IN -2.54,-1.775; OUT 2.54,-1.775
RFM12B = smd 2.54 x 1.27: ANT 8,-6; FFS -8,2; GND 8,-2; IRQ -8,4; P$8 -8,0; P$9 -8,-2; P$10 -8,-4; P$12 -8,-6; P$16 8,0; SCK 8,4; SDI 8,2; SDO -8,6; SEL 8,6; VDD 8,-4
RESONATOR-SMD = smd 0.7 x 1.7: 1 -1.2,0; 2 0,0; 3 1.2,0
CRYSTAL-SMD-3.2X2.5 = smd 1.4 x 1.2: 1 -1.1,-0.9; 2 1.1,-0.9; 3 1.1,0.9; 4 -1.1,0.9

### Placement (x,y rotation side)
A  62.36,25.85 0 top
C1  28.83,24.89 270 top
C1-C2  3.68,17.02 180 bottom
C2  3.68,14.99 180 bottom
C3  15.11,6.6 180 bottom
C4  24.77,23.37 270 bottom
C5  18.67,23.37 90 bottom
C6  36.7,22.35 180 top
C7  20.96,9.53 0 bottom
C9  23.11,16 90 top
C10  20.32,16 90 top
C11  37.47,9.78 0 top
C12  17.65,16 90 top
ENC28J60  21.72,16 0 bottom
FTDI  28.96,9.65 90 top
G  58.3,25.85 0 top
IC1  21.97,9.91 0 top
IC6  47.12,7.62 0 top
L1  21.74,20.17 90 top
P1  44.2,24.89 180 top
P2  16.26,29.97 180 top
P3  44.2,29.97 180 top
P4  31.5,7.11 0 top
PAD1  3.56,32.51 0 top
PAD2  6.1,32.51 0 top
PAD3  8.64,32.51 0 top
PAD4  11.18,32.51 0 top
PAD5  13.72,32.51 0 top
PAD6  16.26,32.51 0 top
PAD7  18.8,32.51 0 top
PAD8  21.34,32.51 0 top
PAD9  23.88,32.51 0 top
PAD10  26.42,32.51 0 top
PAD11  28.96,32.51 0 top
PAD12  31.5,32.51 0 top
PAD13  34.04,32.51 0 top
PAD14  36.58,32.51 0 top
PAD15  39.12,32.51 0 top
PAD16  41.66,32.51 0 top
PAD17  44.2,32.51 0 top
PAD18  46.74,32.51 0 top
PAD19  49.28,32.51 0 top
PAD20  51.82,32.51 0 top
PAD21  54.36,32.51 0 top
PAD22  56.9,32.51 0 top
PAD23  59.44,32.51 0 top
PAD24  61.98,32.51 0 top
PAD25  3.56,35.05 0 top
PAD26  6.1,35.05 0 top
PAD27  8.64,35.05 0 top
PAD28  11.18,35.05 0 top
PAD29  13.72,35.05 0 top
PAD30  16.26,35.05 0 top
PAD31  18.8,35.05 0 top
PAD32  21.34,35.05 0 top
PAD33  23.88,35.05 0 top
PAD34  26.42,35.05 0 top
PAD35  28.96,35.05 0 top
PAD36  31.5,35.05 0 top
PAD37  34.04,35.05 0 top
PAD38  36.58,35.05 0 top
PAD39  39.12,35.05 0 top
PAD40  41.66,35.05 0 top
PAD41  44.2,35.05 0 top
PAD42  46.74,35.05 0 top
PAD43  49.28,35.05 0 top
PAD44  51.82,35.05 0 top
PAD45  54.36,35.05 0 top
PAD46  56.9,35.05 0 top
PAD47  59.44,35.05 0 top
PAD48  61.98,35.05 0 top
PAD49  3.56,37.59 0 top
PAD50  6.1,37.59 0 top
PAD51  8.64,37.59 0 top
PAD52  11.18,37.59 0 top
PAD53  13.72,37.59 0 top
PAD54  16.26,37.59 0 top
PAD55  18.8,37.59 0 top
PAD56  21.34,37.59 0 top
PAD57  23.88,37.59 0 top
PAD58  26.42,37.59 0 top
PAD59  28.96,37.59 0 top
PAD60  31.5,37.59 0 top
PAD61  34.04,37.59 0 top
PAD62  36.58,37.59 0 top
PAD63  39.12,37.59 0 top
PAD64  41.66,37.59 0 top
PAD65  44.2,37.59 0 top
PAD66  46.74,37.59 0 top
PAD67  49.28,37.59 0 top
PAD68  51.82,37.59 0 top
PAD69  54.36,37.59 0 top
PAD70  56.9,37.59 0 top
PAD71  59.44,37.59 0 top
PAD72  61.98,37.59 0 top
PAD73  3.56,40.13 0 top
PAD74  6.1,40.13 0 top
PAD75  8.64,40.13 0 top
PAD76  11.18,40.13 0 top
PAD77  13.72,40.13 0 top
PAD78  16.26,40.13 0 top
PAD79  18.8,40.13 0 top
PAD80  21.34,40.13 0 top
PAD81  23.88,40.13 0 top
PAD82  26.42,40.13 0 top
PAD83  28.96,40.13 0 top
PAD84  31.5,40.13 0 top
PAD85  34.04,40.13 0 top
PAD86  36.58,40.13 0 top
PAD87  39.12,40.13 0 top
PAD88  41.66,40.13 0 top
PAD89  44.2,40.13 0 top
PAD90  46.74,40.13 0 top
PAD91  49.28,40.13 0 top
PAD92  51.82,40.13 0 top
PAD93  54.36,40.13 0 top
PAD94  56.9,40.13 0 top
PAD95  59.44,40.13 0 top
PAD96  61.98,40.13 0 top
PAD97  3.56,42.67 0 top
PAD98  6.1,42.67 0 top
PAD99  8.64,42.67 0 top
PAD100  11.18,42.67 0 top
PAD101  13.72,42.67 0 top
PAD102  16.26,42.67 0 top
PAD103  18.8,42.67 0 top
PAD104  21.34,42.67 0 top
PAD105  23.88,42.67 0 top
PAD106  26.42,42.67 0 top
PAD107  28.96,42.67 0 top
PAD108  31.5,42.67 0 top
PAD109  34.04,42.67 0 top
PAD110  36.58,42.67 0 top
PAD111  39.12,42.67 0 top
PAD112  41.66,42.67 0 top
PAD113  44.2,42.67 0 top
PAD114  46.74,42.67 0 top
PAD115  49.28,42.67 0 top
PAD116  51.82,42.67 0 top
PAD117  54.36,42.67 0 top
PAD118  56.9,42.67 0 top
PAD119  59.44,42.67 0 top
PAD120  61.98,42.67 0 top
PAD121  3.56,45.21 0 top
PAD122  6.1,45.21 0 top
PAD123  8.64,45.21 0 top
PAD124  11.18,45.21 0 top
PAD125  13.72,45.21 0 top
PAD126  16.26,45.21 0 top
PAD127  18.8,45.21 0 top
PAD128  21.34,45.21 0 top
PAD129  23.88,45.21 0 top
PAD130  26.42,45.21 0 top
PAD131  28.96,45.21 0 top
PAD132  31.5,45.21 0 top
PAD133  34.04,45.21 0 top
PAD134  36.58,45.21 0 top
PAD135  39.12,45.21 0 top
PAD136  41.66,45.21 0 top
PAD137  44.2,45.21 0 top
PAD138  46.74,45.21 0 top
PAD139  49.28,45.21 0 top
PAD140  51.82,45.21 0 top
PAD141  54.36,45.21 0 top
PAD142  56.9,45.21 0 top
PAD143  59.44,45.21 0 top
PAD144  61.98,45.21 0 top
PAD145  3.56,47.75 0 top
PAD146  6.1,47.75 0 top
PAD147  8.64,47.75 0 top
PAD148  11.18,47.75 0 top
PAD149  13.72,47.75 0 top
PAD150  16.26,47.75 0 top
PAD151  18.8,47.75 0 top
PAD152  21.34,47.75 0 top
PAD153  23.88,47.75 0 top
PAD154  26.42,47.75 0 top
PAD155  28.96,47.75 0 top
PAD156  31.5,47.75 0 top
PAD157  34.04,47.75 0 top
PAD158  36.58,47.75 0 top
PAD159  39.12,47.75 0 top
PAD160  41.66,47.75 0 top
PAD161  44.2,47.75 0 top
PAD162  46.74,47.75 0 top
PAD163  49.28,47.75 0 top
PAD164  51.82,47.75 0 top
PAD165  54.36,47.75 0 top
PAD166  56.9,47.75 0 top
PAD167  59.44,47.75 0 top
PAD168  61.98,47.75 0 top
PAD169  3.56,50.29 0 top
PAD170  6.1,50.29 0 top
PAD171  8.64,50.29 0 top
PAD172  11.18,50.29 0 top
PAD173  13.72,50.29 0 top
PAD174  16.26,50.29 0 top
PAD175  18.8,50.29 0 top
PAD176  21.34,50.29 0 top
PAD177  23.88,50.29 0 top
PAD178  26.42,50.29 0 top
PAD179  28.96,50.29 0 top
PAD180  31.5,50.29 0 top
PAD181  34.04,50.29 0 top
PAD182  36.58,50.29 0 top
PAD183  39.12,50.29 0 top
PAD184  41.66,50.29 0 top
PAD185  44.2,50.29 0 top
PAD186  46.74,50.29 0 top
PAD187  49.28,50.29 0 top
PAD188  51.82,50.29 0 top
PAD189  54.36,50.29 0 top
PAD190  56.9,50.29 0 top
PAD191  59.44,50.29 0 top
PAD192  61.98,50.29 0 top
PAD193  3.56,52.83 0 top
PAD194  6.1,52.83 0 top
PAD195  8.64,52.83 0 top
PAD196  11.18,52.83 0 top
PAD197  13.72,52.83 0 top
PAD198  16.26,52.83 0 top
PAD199  18.8,52.83 0 top
PAD200  21.34,52.83 0 top
PAD201  23.88,52.83 0 top
PAD202  26.42,52.83 0 top
PAD203  28.96,52.83 0 top
PAD204  31.5,52.83 0 top
PAD205  34.04,52.83 0 top
PAD206  36.58,52.83 0 top
PAD207  39.12,52.83 0 top
PAD208  41.66,52.83 0 top
PAD209  44.2,52.83 0 top
PAD210  46.74,52.83 0 top
PAD211  49.28,52.83 0 top
PAD212  51.82,52.83 0 top
PAD213  54.36,52.83 0 top
PAD214  56.9,52.83 0 top
PAD215  59.44,52.83 0 top
PAD216  61.98,52.83 0 top
PAD217  3.56,55.37 0 top
PAD218  6.1,55.37 0 top
PAD219  8.64,55.37 0 top
PAD220  11.18,55.37 0 top
PAD221  13.72,55.37 0 top
PAD222  16.26,55.37 0 top
PAD223  18.8,55.37 0 top
PAD224  21.34,55.37 0 top
PAD225  23.88,55.37 0 top
PAD226  26.42,55.37 0 top
PAD227  28.96,55.37 0 top
PAD228  31.5,55.37 0 top
PAD229  34.04,55.37 0 top
PAD230  36.58,55.37 0 top
PAD231  39.12,55.37 0 top
PAD232  41.66,55.37 0 top
PAD233  44.2,55.37 0 top
PAD234  46.74,55.37 0 top
PAD235  49.28,55.37 0 top
PAD236  51.82,55.37 0 top
PAD237  54.36,55.37 0 top
PAD238  56.9,55.37 0 top
PAD239  59.44,55.37 0 top
PAD240  61.98,55.37 0 top
PAD241  3.56,57.91 0 top
PAD242  6.1,57.91 0 top
PAD243  8.64,57.91 0 top
PAD244  11.18,57.91 0 top
PAD245  13.72,57.91 0 top
PAD246  16.26,57.91 0 top
PAD247  18.8,57.91 0 top
PAD248  21.34,57.91 0 top
PAD249  23.88,57.91 0 top
PAD250  26.42,57.91 0 top
PAD251  28.96,57.91 0 top
PAD252  31.5,57.91 0 top
PAD253  34.04,57.91 0 top
PAD254  36.58,57.91 0 top
PAD255  39.12,57.91 0 top
PAD256  41.66,57.91 0 top
PAD257  44.2,57.91 0 top
PAD258  46.74,57.91 0 top
PAD259  49.28,57.91 0 top
PAD260  51.82,57.91 0 top
PAD261  54.36,57.91 0 top
PAD262  56.9,57.91 0 top
PAD263  59.44,57.91 0 top
PAD264  61.98,57.91 0 top
PAD265  13.72,60.45 0 top
PAD266  16.26,60.45 0 top
PAD267  18.8,60.45 0 top
PAD268  21.34,60.45 0 top
PAD269  23.88,60.45 0 top
PAD270  26.42,60.45 0 top
PAD271  28.96,60.45 0 top
PAD272  31.5,60.45 0 top
PAD273  34.04,60.45 0 top
PAD274  36.58,60.45 0 top
PAD275  39.12,60.45 0 top
PAD276  41.66,60.45 0 top
PAD277  44.2,60.45 0 top
PAD278  46.74,60.45 0 top
PAD279  49.28,60.45 0 top
PAD280  51.82,60.45 0 top
PAD281  13.72,62.99 0 top
PAD282  16.26,62.99 0 top
PAD283  18.8,62.99 0 top
PAD284  21.34,62.99 0 top
PAD285  23.88,62.99 0 top
PAD286  26.42,62.99 0 top
PAD287  28.96,62.99 0 top
PAD288  31.5,62.99 0 top
PAD289  34.04,62.99 0 top
PAD290  36.58,62.99 0 top
PAD291  39.12,62.99 0 top
PAD292  41.66,62.99 0 top
PAD293  44.2,62.99 0 top
PAD294  46.74,62.99 0 top
PAD295  49.28,62.99 0 top
PAD296  51.82,62.99 0 top
PAD297  21.34,29.97 0 top
PAD298  23.88,29.97 0 top
PAD299  26.42,29.97 0 top
PAD300  49.28,29.97 0 top
PAD301  51.82,29.97 0 top
PAD302  54.36,29.97 0 top
PAD303  56.9,29.97 0 top
PAD304  59.44,29.97 0 top
PAD305  61.98,29.97 0 top
R1  32.51,9.78 0 top
R1-R4  9.02,12.95 180 bottom
R2  9.02,14.99 180 bottom
R3  9.02,17.02 180 bottom
R4  9.02,19.05 0 bottom
R5  15.11,23.37 180 bottom
R6  15.11,8.64 180 bottom
R7  25.78,16 90 top
R8  15.11,21.34 0 bottom
R9  15.11,25.4 0 bottom
RJ1  5.84,16 180 top
SJ1  13.72,6.48 0 top
SV7  45.47,16 270 top
U1  37.34,16 90 top
U2  21.97,8.89 0 top
U$1  56.39,16.13 90 top
U$2  [NODEPARAMS]  48.9,16 0 top
X1  41.91,10.16 90 top
X2  21.72,23.37 0 bottom

### Tracks (layer width: path | path; a pad name or v marks a point on that pad's centre or on a via)
3.3V  (via drill 0.3)  (1 unrouted)
  Top 0.381: 25.78,16.51 R7.2 | v17.65,17.78 C12.2 C10.2 | U1.18 39.37,20.32 v39.37,21.84 | v39.37,21.84 45.97,21.84 46.74,21.08 SV7.2 49.4,19.81 v49.78,20.19 | U1.4 36.96,11.56 36.96,10.92 37.21,10.67 38.35,10.67 | U1.6 38.61,11.56 38.61,10.92 38.35,10.67 | 57.59,20.26 56.52,19.18 53.72,19.18 50.17,15.62 50.17,15.24 49.53,14.61 49.53,11.56 48.9,10.92 v48.9,9.91 48.9,8.13 48.07,7.3 IC6.2 48.13,6.46 | 57.59,20.26 58.8,21.46 59.82,21.46 60.45,22.1 60.45,23.37 U$1.VDD | v30.48,8.51 30.73,8.76 33.27,8.76 | 33.27,9.78 33.27,8.76 | 33.02,9.78 33.27,9.78 | 33.27,9.78 R1.2 | v57.66,20.19 57.59,20.26 | P4.4 39.12,8.38 38.73,8.76 38.31,8.76 | 38.31,8.76 33.27,8.76 | IC1.3 24.52,6.77 | R7.2 C9.2 21.74,16.85 | v39.37,21.84 39.37,22.22 38.23,23.37 37.21,23.37 36.58,24 P1.4 P3.4 | P2.4 8.64,27.18 v11.3,24.51 | 38.2,9.89 C11.2 38.31,8.76 | 20.47,16.85 21.74,16.85 | R7.2 v25.78,18.03 | 38.35,10.67 38.35,10.03 38.23,9.91 | L1.1 21.74,16.85
  Top 0.406: U2.OUT 24.51,7.04 IC1.3 | v20.32,18.03 20.32,16.88 | 20.32,16.88 C10.2 | 20.32,16.88 20.47,16.85
  Bottom 0.381: v11.3,24.51 11.3,23.49 12.7,22.1 13.59,22.1 14.22,21.46 | 14.22,21.46 R8.2 | ENC28J60.25 24,19.43 24,18.54 24.51,18.03 v25.78,18.03 26.04,18.29 26.04,19.43 | 26.04,19.43 ENC28J60.28 | 14.22,21.46 13.46,20.7 13.46,18.41 13.97,17.91 17.53,17.91 v17.65,17.78 17.49,17.92 ENC28J60.15 | v48.9,9.91 45.34,9.91 44.7,9.27 40.52,9.27 39.12,7.87 P4.4 | v49.78,20.19 50.8,19.18 53.59,19.18 54.48,20.07 57.53,20.07 v57.66,20.19 | 26.04,19.43 26.04,20.32 26.8,21.08 33.78,21.08 35.05,19.81 36.7,19.81 38.73,21.84 v39.37,21.84 | ENC28J60.19 20.09,18.72 20.09,18.64 20.32,18.41 20.32,18.39 | U2.OUT 29.09,7.12 v30.48,8.51 | ENC28J60.20 20.74,18.81 20.32,18.39 | 20.32,18.39 v20.32,18.03
A0
  Top 0.203: U1.23 35.43,20.32 35.43,21.21 34.04,22.61 P1.5
A1  (via drill 0.3)
  Top 0.203: U1.24 34.54,21.34 32.77,23.11 v32.77,26.16 | v26.67,26.16 26.54,26.29 26.29,26.29 25.53,27.05 11.43,27.05 v10.41,28.07
  Bottom 0.203: v32.77,26.16 32.39,26.54 30.73,26.54 30.35,26.16 v26.67,26.16 | v10.41,28.07 6.73,28.07 6.1,28.7 P2.5
A2  (via drill 0.3)
  Top 0.203: U1.25 33.27,18.8 33.3,18.82 33.3,21.06 30.23,24.13 30.23,27.3 v30.61,27.69
  Bottom 0.203: P3.5 34.04,28.57 33.15,27.69 v30.61,27.69
A3  (via drill 0.3)
  Top 0.203: v32.64,19.81 32.39,19.81 32,19.43 32,18.41 32.39,18.03 33.02,18.03 U1.26 | v41.15,21.08 45.34,21.08 v45.47,20.95
  Bottom 0.203: v32.64,19.81 34.16,19.81 34.8,19.18 36.96,19.18 38.61,20.83 40.89,20.83 v41.15,21.08 | v45.47,20.95 45.59,21.08 47.5,21.08 48.39,20.19 48.39,19.68 48.77,19.3 48.77,18.16 51.69,15.24 51.69,9.78 51.05,9.14 45.47,9.14 44.83,8.51 42.8,8.51 P4.5
B0  (via drill 0.3)
  Top 0.203: U1.12 41.78,15.62 42.67,15.62 42.93,15.37 42.93,12.7 43.43,12.19 SV7.7 44.2,11.3 45.59,9.91 v45.59,8.25 | v16.76,24.38 18.42,26.04 25.27,26.04 25.91,25.4 v25.91,23.75 25.91,23.24 26.04,23.11 26.04,20.32 24.38,18.67 23.75,18.67 v23.11,18.03 | v41.53,23.24 v42.8,23.24
  Bottom 0.203: v16.76,24.38 16.89,24.26 16.89,22.73 16,21.84 16,21.46 R8.1 | v23.11,18.03 23.11,16 20.7,13.59 20.7,12.19 ENC28J60.9 | v45.59,8.25 50.8,8.25 52.32,9.78 52.32,15.24 49.28,18.29 49.28,19.43 48.9,19.81 48.9,21.72 48.39,22.22 43.81,22.22 v42.8,23.24 | v41.53,23.24 40.89,22.61 38.61,22.61 36.45,20.45 35.31,20.45 33.91,21.84 31.88,21.84 29.97,23.75 v25.91,23.75
B1
  Top 0.203: 41.66,16.38 U1.13 41.78,16.38 43.05,16.38 43.43,16 44.7,16 45.47,15.24 45.47,13.46 SV7.8 46.74,11.43 46.23,10.92 46.23,7.11 IC6.1
B2  (via drill 0.3)
  Top 0.203: v48.13,21.59 50.04,21.59 50.42,21.97 50.42,23.37 U$1.SEL | U1.14 41.78,17.14 42.67,17.14 v42.93,17.4
  Bottom 0.203: v42.93,17.4 42.93,20.57 43.94,21.59 v48.13,21.59
D4  (via drill 0.3)
  Top 0.203: v35.43,13.72 35.43,11.68 U1.2
  Bottom 0.203: v35.43,13.72 35.43,13.97 36.2,14.73 37.21,14.73 38.35,15.88 38.35,19.94 38.73,20.32 41.28,20.32 42.16,21.21 42.16,24.64 P1.2
D5  (via drill 0.3)
  Top 0.203: U1.9 40.77,13.2 40.39,13.59 38.48,13.59 37.47,14.61 35.43,14.61 34.92,15.11 v34.92,17.91 | v30.86,19.05 30.35,18.54 27.81,18.54 26.54,19.81 26.54,23.11 27.31,23.88 27.31,26.54 27.05,26.8 26.42,26.8 25.65,27.56 14.86,27.56 13.72,28.7 P2.2
  Bottom 0.203: v34.92,17.91 32.89,17.91 31.75,19.05 v30.86,19.05
D6  (via drill 0.3)
  Top 0.203: U1.10 38.7,14 37.47,15.24 35.69,15.24 35.56,15.37 v35.56,18.54 | v31.11,20.32 30.35,21.08 27.81,21.08 27.05,21.84 27.05,22.86 27.81,23.62 27.81,26.54 v28.32,27.05
  Bottom 0.203: v35.56,18.54 32.89,18.54 v31.11,20.32 | P3.2 41.66,28.7 40.77,27.81 34.04,27.81 33.27,27.05 v28.32,27.05
D7  (via drill 0.3)
  Top 0.203: U1.11 41.66,14.73 41.53,14.86 v40.39,14.86
  Bottom 0.203: v40.39,14.86 39.83,14.86 35.84,10.87 34.62,10.87 33.78,10.04 33.78,9.4 34.04,9.14 P4.2
DTR
  Top 0.203: FTDI.6 28.96,23.88 28.83,24 C1.2
GND  (via drill 0.3)
  Top 0.381: U1.5 37.72,11.68 37.72,12.57 37.34,12.95 36.58,12.95 36.2,12.57 36.2,11.94 U1.3 36.2,11.65 36.2,10.67 36.61,10.25 C11.1 v35.56,9.78 | v40.26,10.16 X1.2 42.8,10.16 v43.43,10.79 | 48.77,14.73 48.77,12.45 v47.12,10.79 47.12,8.76 | 48.77,14.73 48.77,14.86 49.53,15.62 49.53,16 53.34,19.81 56.13,19.81 58.42,22.1 58.42,23.37 U$1.GND 58.42,23.49 58.29,23.49 G.1 49.34,25.85 45.97,22.48 40.13,22.48 39.12,23.49 P1.3 P3.3 | RJ1.SHIELD0 4.06,8 0.89,11.18 RJ1.Y- | 36.96,20.32 U1.21 | C12.1 17.65,15.11 | 17.65,15.11 v17.65,11.05 | v25.02,13.59 24.77,13.84 24.77,14.73 24.35,15.15 C9.1 | IC1.2 22.08,6.85 | 17.65,15.11 17.69,15.15 C10.1 23.24,15.15 | SV7.6 48.77,14.73
  Top 0.406: 23.24,15.15 23.24,15.11 | 36.96,20.32 36.96,21.21 36.7,21.46 36.2,21.46 35.94,21.72 35.94,22.35 | RJ1.GND 15.88,11.56 16.38,11.05 v17.65,11.05
  Bottom 0.381: v40.26,10.16 38.86,8.76 36.58,8.76 | v47.12,10.79 v43.43,10.79 | 11.18,25.4 10.16,25.4 RJ1.SHIELD1 4.06,24 0.89,20.83 RJ1.G- 0.89,17.02 | 11.18,25.4 R9.2 | 0.89,17.02 C1-C2.1 | 0.89,14.99 0.89,17.02 | C2.1 0.89,14.99 | RJ1.Y- 0.89,14.99 | 24.51,10.29 23.75,9.53 C7.1 | 24.51,10.29 25.29,11.07 ENC28J60.2 25.29,13.32 v25.02,13.59 | 18.67,22.48 18.67,21.59 v19.43,20.83 | 18.67,22.48 C5.1 18.67,22.61 | v19.43,20.83 19.43,19.56 ENC28J60.18 19.43,19.3 v19.43,13.97 19.44,13.33 ENC28J60.11 | C4.1 24.77,25.27 24.38,25.65 18.16,25.65 17.53,25.02 17.53,22.86 17.91,22.48 18.67,22.48 | 24.77,24.13 C4.1 | v19.43,20.83 21.72,20.83 | C4.1 25.02,24.51 30.1,24.51 32.13,22.48 34.16,22.48 35.56,21.08 36.07,21.08 38.23,23.24 38.73,23.24 39.12,23.62 P1.3 | v17.65,11.05 17.27,10.67 17.27,8 16.89,7.62 14.86,7.62 14.48,7.24 14.48,6.48 C3.1 14.22,6.48 11.81,6.48 10.29,8 RJ1.SHIELD0 | ENC28J60.22 22.04,20.5 21.72,20.83 | ENC28J60.21 21.39,20.5 21.72,20.83 | FTDI.1 25.15,9.65 24.51,10.29 | 11.18,25.4 P2.3 | v35.56,9.78 36.58,8.76 | 36.58,8.76 P4.3
  other vias: 34.8,23.11
  pour Bottom: 64.52,5.84 64.52,26.54 0,26.54 0,5.84
  pour Top: 64.52,5.84 64.52,26.54 0,26.54 0,5.84
INT0  (via drill 0.3)
  Top 0.203: v31.88,12.32 31.88,12.95 32.13,13.21 33.02,13.21 U1.32 | v36.32,13.97 37.34,13.97 38.35,12.95 v40.13,12.95 | v50.42,11.05 52.45,9.02 52.45,7.49 U$1.IRQ
  Bottom 0.203: v31.88,12.32 32,12.45 35.05,12.45 36.32,13.72 v36.32,13.97 | v40.13,12.95 40.51,13.34 48.64,13.34 50.42,11.56 v50.42,11.05
INT1  (via drill 0.3)
  Top 0.203: v44.2,10.03 P4.6 | 34.54,11.68 v34.54,9.78 | 34.54,11.68 U1.1 | 34.54,11.68 34.54,12.57 34.29,12.83 34.29,19.05 33.78,19.56 33.78,21.34 31.5,23.62 P1.6 P3.6 | v10.41,26.54 25.4,26.54 v26.67,25.27
  Bottom 0.203: v44.2,10.03 41.4,10.03 40.51,10.92 36.53,10.92 36.07,10.46 34.98,10.46 34.54,10.03 v34.54,9.78 | P2.6 3.56,28.7 4.95,27.3 9.65,27.3 v10.41,26.54 | v26.67,25.27 26.8,25.15 P1.6
LED-A  (via drill 0.3)
  Top 0.203: v12.95,23.37 10.8,23.37 6.6,19.18 4.32,19.18 RJ1.G+
  Bottom 0.203: v12.95,23.37 R5.1
LED-B
  Bottom 0.203: RJ1.Y+ 3.94,12.45 7.11,12.45 10.92,8.64 R6.1 14.35,8.64
MISO  (via drill 0.3)
  Top 0.203: v22.61,11.05 23.24,10.41 24.64,10.41 25.4,11.18 26.29,11.18 v26.92,10.54 | v40.39,18.8 41.66,18.8 U1.16 41.78,18.8 43.18,18.8 SV7.1 | v50.42,9.91 50.42,7.49 U$1.SDO
  Bottom 0.203: v26.92,10.54 27.18,10.79 31.24,10.79 32.44,11.99 35.23,11.99 38.99,15.75 38.99,16.38 40.39,17.78 v40.39,18.8 | ENC28J60.6 22.61,12.07 v22.61,11.05 | v50.42,9.91 51.05,10.54 51.05,15.24 47.75,18.54 45.47,18.54 SV7.1
MOSI  (via drill 0.3)
  Top 0.203: v37.72,17.02 39.88,17.02 40.89,18.03 41.66,18.03 U1.15 41.78,18.03 43.31,18.03 43.81,18.54 45.47,18.54 SV7.4 48.01,18.54 49.28,18.54 v50.93,20.19 | v54.36,20.83 54.36,23.37 U$1.SDI
  Bottom 0.203: v37.72,17.02 37.72,16 36.96,15.24 36.07,15.24 33.78,12.95 30.73,12.95 30.23,13.46 26.16,13.46 25.27,14.35 22.86,14.35 22.1,13.59 22.1,12.19 ENC28J60.7 | v54.36,20.83 53.34,19.81 51.31,19.81 v50.93,20.19
N$1
  Top 0.203: U1.7 39.37,11.56 39.37,10.03 40.39,9.02 41.91,9.02 X1.1
N$2  (1 unrouted)
  Top 0.203: C6.1 37.72,22.19
  Top 0.305: 37.72,22.19 37.72,20.32
N$9  (via drill 0.3)
  Top 0.203: v24.89,21.34 23.88,22.35 v15.62,22.35
  Bottom 0.203: v15.62,22.35 16,22.73 16,23.37 R5.2 | v24.89,21.34 24.89,20.95 25.27,20.7 25.27,19.56 ENC28J60.27
N$10  (via drill 0.3)
  Top 0.203: v16.64,12.32 16.64,13.59 16.51,13.72 16.51,17.65 19,20.14 22.68,20.14 v23.88,21.34
  Bottom 0.203: R6.2 16.64,8.64 v16.64,12.32 | v23.88,21.34 24.64,20.57 24.64,19.56 ENC28J60.26
N$12  (via drill 0.3)
  Top 0.203: v15.11,24.38 15.11,23.37 14.48,22.73 10.92,22.73 6.35,18.16 6.35,13.34 9.02,10.67 v11.3,10.67
  Bottom 0.203: v15.11,24.38 15.49,24.38 15.88,24.77 15.88,25.4 R9.1 | v11.3,10.67 13.08,10.67 13.46,10.29 15.49,10.29 16.13,10.92 16.13,11.94 16,12.07 16,12.57 16.64,13.21 17.4,13.21 17.53,13.08 17.53,12.19 ENC28J60.14
N$13  (via drill 0.3)
  Top 0.203: v18.8,9.91 25.27,9.91 v25.91,10.54
  Bottom 0.203: C3.2 16.76,6.6 17.91,7.75 17.91,9.02 v18.8,9.91 | ENC28J60.1 25.91,12.07 v25.91,10.54
N$15
  Bottom 0.203: 22.99,22.35 X2.1 | ENC28J60.24 23.37,19.56 23.37,20.83 22.86,21.34 22.86,22.48 22.9,22.52 | 22.86,22.43 X2.1 | C4.2 22.9,22.52 | 22.9,22.52 22.87,22.52 X2.1
N$16
  Bottom 0.203: C5.2 18.67,24.26 20.45,24.26 X2.3 20.7,24.26 21.46,24.26 21.72,24 21.72,21.72 22.73,20.7 22.73,19.68 ENC28J60.23
N$18
  Top 0.203: U$1.ANT 62.36,23.49 62.36,25.15 A.1
N$21
  Top 0.203: U1.8 40.26,11.56 40.39,11.43 41.91,11.43 X1.3
POE+
  Top 0.381: RJ1.NC SJ1.1
PWR  (via drill 0.3)
  Top 0.381: 13.72,6.48 SJ1.3 15.24,7.75 16.64,9.14 26.8,9.14 28.57,7.37 P4.1 | v53.34,20.83 48.77,16.26 v48.77,16 | v33.15,11.18 31.88,11.18 30.99,12.07 30.99,14.48 30.73,14.73 FTDI.3 | v34.04,26.8 v32.39,28.45
  Bottom 0.381: v53.34,20.83 49.53,24.64 P1.1 42.04,26.8 | v48.77,16 41.91,16 41.4,16.51 40,16.51 39.62,16.13 39.62,15.49 35.56,11.43 33.4,11.43 v33.15,11.18 31.5,9.53 P4.1 | P2.1 17.53,28.45 v32.39,28.45 | 42.04,26.8 v34.04,26.8 | P3.1 44.2,28.96 42.04,26.8
RCT
  Bottom 0.203: C2.2 R2.1 8.17,14.31 8.51,13.97 9.91,13.97 | 9.78,13.08 R1-R4.2 9.91,13.08 9.91,13.97 | 9.91,13.97 11.81,13.97 12.19,14.35 RJ1.P5
RST  (via drill 0.3)
  Top 0.203: R7.1 25.78,12.83 25.72,12.76 | v24,11.05 25.72,12.76 | 25.72,12.76 27.43,11.05 30.1,11.05 31.37,9.78 R1.1 | 33.15,15.62 U1.29 33.02,15.62 32.39,15.62 32,16 31.37,16 | v40.39,15.75 39.75,16.38 v36.32,16.38 | 31.37,16 26.92,16 26.16,15.24 25.78,15.24 R7.1 | 25.91,14.86 R7.1 | C1.1 28.92,25.65 29.59,25.65 29.72,25.53 29.72,24 32.51,21.21 32.51,20.7 31.5,19.68 31.5,18.54 v31.37,18.41 31.37,16
  Bottom 0.203: v24,11.05 23.37,10.41 21.08,10.41 20.07,11.43 20.07,12.07 ENC28J60.10 | v31.37,18.41 33.4,16.38 v36.32,16.38 | v40.39,15.75 41.02,15.75 42.04,14.73 SV7.5
RX+
  Bottom 0.203: 12.19,17.02 10.8,15.62 10.8,15.24 10.54,14.99 R2.2 9.78,14.99 | 12.19,17.02 RJ1.RD+ 12.19,18.03 | 12.19,17.02 13.34,15.88 13.34,13.97 14.35,12.95 15.11,12.95 15.77,13.61 17.63,13.61 18.16,13.08 18.16,12.19 ENC28J60.13
RX-  (via drill 0.3)
  Top 0.203: v13.84,12.57 13.84,13.21 RJ1.RD-
  Bottom 0.203: v13.84,12.57 12.7,11.43 9.14,11.43 8.25,12.32 8.25,13.08 R1-R4.1 | RJ1.RD- 17.78,14.1 18.8,13.08 18.8,12.19 ENC28J60.12
RXD  (via drill 0.3)
  Top 0.203: U1.30 33.02,14.73 32.26,14.73 v31.75,15.24
  Bottom 0.203: v31.75,15.24 31.75,16 30.48,17.27 FTDI.4
SCK  (via drill 0.3)
  Top 0.203: U1.17 40.26,20.19 40.26,19.56 38.99,18.29 v38.99,17.91 v37.72,17.91 | U$1.SCK 52.45,23.37 52.45,20.83 47.62,16 46.36,16 45.08,17.27 SV7.3
  Bottom 0.203: v37.72,17.91 37.08,17.27 37.08,16.26 36.58,15.75 35.81,15.75 33.53,13.46 31.37,13.46 30.99,13.84 30.99,15.49 30.48,16 26.16,16 25.27,15.11 22.86,15.11 21.34,13.59 21.34,12.19 ENC28J60.8 | v38.99,17.91 38.99,18.54 39.88,19.43 40.64,19.43 41.02,19.05 41.02,18.03 42.29,16.76 43.69,16.76 SV7.3
TCT  (via drill 0.3)
  Top 0.305: L1.2 20.61,21.07 20.04,21.64 18.85,21.64 14.73,17.53 RJ1.P4 8,16.64 7.62,17.02 v6.98,17.02
  Bottom 0.305: R3.1 v6.98,17.02 | R4.2 7.24,19.05 6.98,18.8 v6.98,17.02 | v6.98,17.02 C1-C2.2
TX+  (via drill 0.3)
  Top 0.203: RJ1.TD+ 16.13,20.45 v17.14,21.46
  Bottom 0.203: R3.2 10.54,17.02 10.8,17.27 10.8,18.16 12.19,19.56 RJ1.TD+ | v17.14,21.46 17.78,21.46 18.8,20.45 18.8,19.56 ENC28J60.17
TX-  (via drill 0.3)
  Top 0.203: v10.8,19.05 11.68,19.05 11.81,19.18 RJ1.TD-
  Bottom 0.203: v10.8,19.05 R4.1 | ENC28J60.16 18.16,19.56 18.16,20.45 17.78,20.83 17.14,20.83 15.49,19.18 RJ1.TD-
TXD  (via drill 0.3)
  Top 0.203: v31.75,14.1 33.02,14.1 U1.31
  Bottom 0.203: v31.75,14.1 32.51,14.86 32.51,16.26 30.23,18.54 29.34,18.54 28.96,18.92 FTDI.5
VIN  (via drill 0.3)
  Top 0.381: SJ1.2 13.72,7.75 15.88,9.91 17.65,9.91 18.42,10.67 v19.43,10.67 | IC1.1 19.62,6.77
  Top 0.406: U2.IN 19.43,7.04 IC1.1
  Bottom 0.381: 20.07,9.53 C7.2 20.07,9.14 | v19.43,10.67 20.07,10.03 20.07,9.53 | 20.07,9.53 20.07,9.14 | 20.07,9.14 19.43,8.51 U2.IN

### Text on the board
_tsilk: TaaraNode Ethernet Proto v1 | TaaraLabs.eu/ep1 | I | A | + | G | D | P | P2 | I | A | + | G | D | P | P3 | A | I | A | + | G | D | P | 1 | + | RFM12B | FTDI | ATMEGA328 | G | P | D | G | + | A | I | POE | PWR
_bsilk: TaaraNode Ethernet Proto v1 | TaaraLabs.eu/ep1 | P2 | P3 | D3* | I | A1 | A | + | G | D5* | D | P | D3* | I | A2 | A | + | G | D6* | D | P | P1 | D3* | I | A0 | A | + | G | D4 | D | P | 1 | + | FTDI | G | TaaraNode | Ethernet Proto v1 | TaaraLabs.eu/ep1 | D7 | A3 | D3* | GND | BLK | P4 | P | D | G | + | A | I